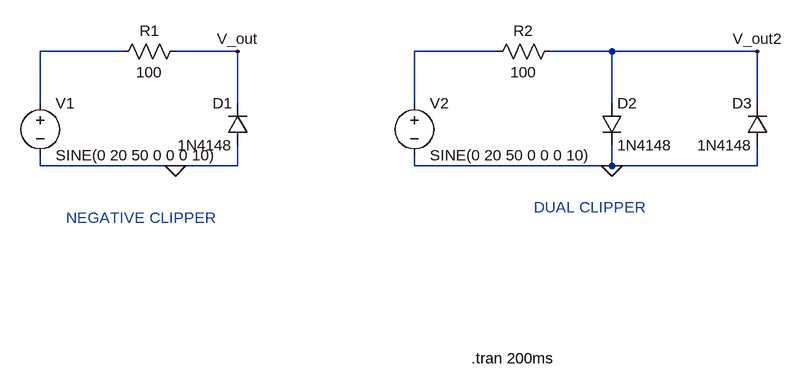
[diagram p0: schematic lab2_clipper_2019A3PS0443H_VISHWAS_GAUTAM.asc]
lab2_clipper_2019A3PS0443H_VISHWAS_GAUTAM.asc, the LTspice schematic file:
Version 4
SHEET 1 1244 680
WIRE 208 192 80 192
WIRE 384 192 288 192
WIRE 784 192 656 192
WIRE 960 192 864 192
WIRE 1184 192 960 192
WIRE 80 272 80 192
WIRE 384 272 384 192
WIRE 656 272 656 192
WIRE 960 272 960 192
WIRE 1184 272 1184 192
WIRE 80 368 80 352
WIRE 288 368 80 368
WIRE 384 368 384 336
WIRE 384 368 288 368
WIRE 656 368 656 352
WIRE 960 368 960 336
WIRE 960 368 656 368
WIRE 1184 368 1184 336
WIRE 1184 368 960 368
FLAG 288 368 0
FLAG 960 368 0
FLAG 384 192 V_out
FLAG 1184 192 V_out2
SYMBOL voltage 80 256 R0
WINDOW 123 0 0 Left 2
WINDOW 39 0 0 Left 2
SYMATTR InstName V1
SYMATTR Value SINE(0 20 50 0 0 0 10)
SYMBOL res 304 176 R90
WINDOW 0 0 56 VBottom 2
WINDOW 3 32 56 VTop 2
SYMATTR InstName R1
SYMATTR Value 100
SYMBOL diode 400 336 R180
WINDOW 0 24 64 Left 2
WINDOW 3 24 0 Left 2
SYMATTR InstName D1
SYMATTR Value 1N4148
SYMBOL voltage 656 256 R0
WINDOW 123 0 0 Left 2
WINDOW 39 0 0 Left 2
SYMATTR InstName V2
SYMATTR Value SINE(0 20 50 0 0 0 10)
SYMBOL res 880 176 R90
WINDOW 0 0 56 VBottom 2
WINDOW 3 32 56 VTop 2
SYMATTR InstName R2
SYMATTR Value 100
SYMBOL diode 944 272 R0
SYMATTR InstName D2
SYMATTR Value 1N4148
SYMBOL diode 1200 336 R180
WINDOW 0 24 64 Left 2
WINDOW 3 24 0 Left 2
SYMATTR InstName D3
SYMATTR Value 1N4148
TEXT 744 664 Left 2 !.tran 200ms
TEXT 120 448 Left 2 ;NEGATIVE CLIPPER
TEXT 840 432 Left 2 ;DUAL CLIPPER

The netlist it stands for:
* lab2_clipper_2019A3PS0443H_VISHWAS_GAUTAM.asc
V1 N001 0 SINE(0 20 50 0 0 0 10)
R1 V_out N001 100
D1 0 V_out 1N4148
V2 N002 0 SINE(0 20 50 0 0 0 10)
R2 V_out2 N002 100
D2 V_out2 0 1N4148
D3 0 V_out2 1N4148
.model D D
.lib standard.dio
.tran 200ms
* NEGATIVE CLIPPER
* DUAL CLIPPER
.backanno
.end

* Results of the author's LTspice run, read from the files saved beside the schematic
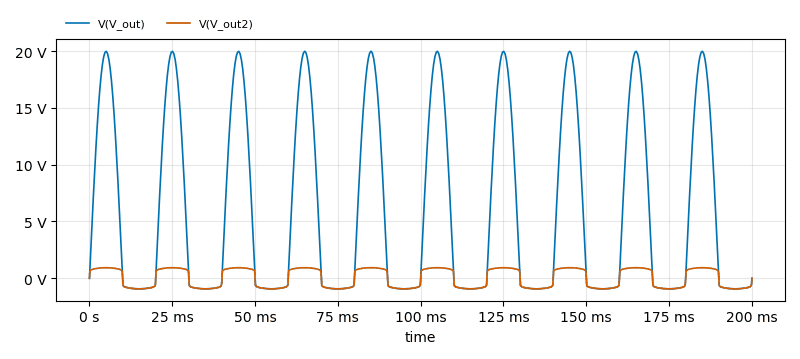
[diagram p1: Transient Analysis of lab2_clipper_2019A3PS0443H_VISHWAS_GAUTAM.asc, plotted from the saved traces]
* Transient Analysis, 1 run:
*   V(V_out): min -930.3 mV, max 19.98 V, average 5.929 V, rms 10.01 V, last -19.29 µV
*   V(V_out2): min -930.3 mV, max 930.3 mV, average 60.13 µV, rms 854.2 mV, last -2.131 µV